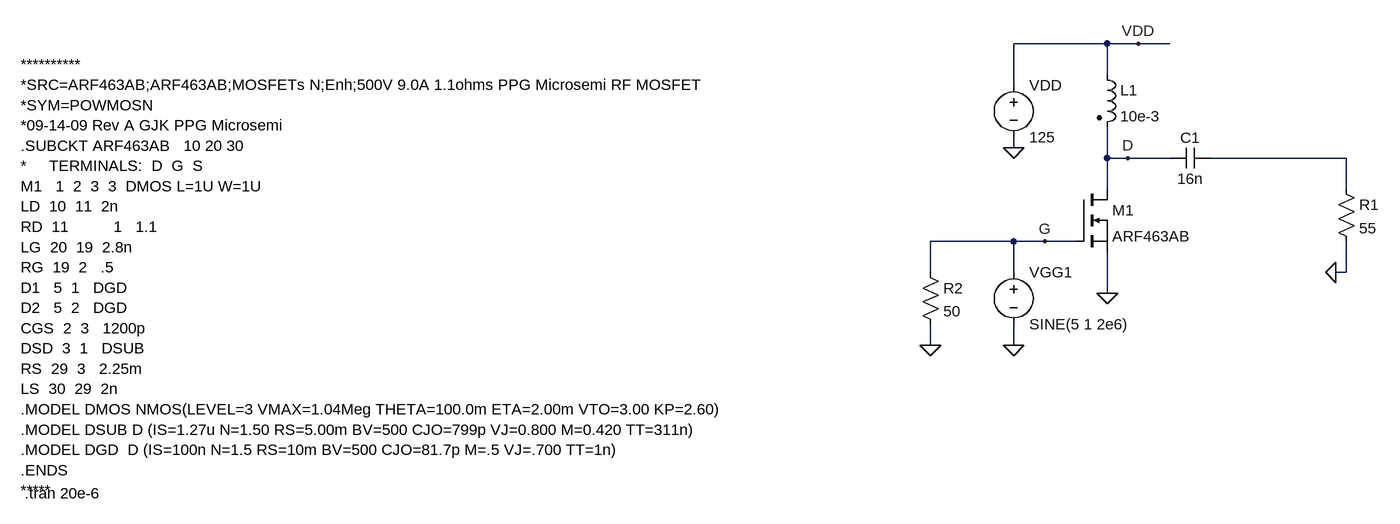
[diagram p0: schematic Clase_A_B.asc]
Clase_A_B.asc, the LTspice schematic file:
Version 4
SHEET 1 880 680
WIRE -480 -784 -624 -784
WIRE -432 -784 -480 -784
WIRE -384 -784 -432 -784
WIRE -480 -736 -480 -784
WIRE -624 -720 -624 -784
WIRE -624 -624 -624 -640
WIRE -480 -608 -480 -656
WIRE -448 -608 -480 -608
WIRE -384 -608 -448 -608
WIRE -112 -608 -320 -608
WIRE -480 -560 -480 -608
WIRE -112 -560 -112 -608
WIRE -624 -480 -752 -480
WIRE -576 -480 -624 -480
WIRE -528 -480 -576 -480
WIRE -752 -432 -752 -480
WIRE -624 -432 -624 -480
WIRE -112 -432 -112 -480
WIRE -112 -432 -128 -432
WIRE -480 -400 -480 -464
WIRE -752 -320 -752 -352
WIRE -624 -320 -624 -352
FLAG -480 -400 0
FLAG -624 -624 0
FLAG -624 -320 0
FLAG -432 -784 VDD
FLAG -448 -608 D
FLAG -576 -480 G
FLAG -128 -432 0
FLAG -752 -320 0
SYMBOL nmos -528 -560 R0
SYMATTR InstName M1
SYMATTR Value ARF463AB
SYMATTR Prefix X
SYMBOL voltage -624 -448 R0
WINDOW 123 0 0 Left 2
WINDOW 39 0 0 Left 2
SYMATTR InstName VGG1
SYMATTR Value SINE(5 1 2e6)
SYMBOL voltage -624 -736 R0
WINDOW 123 0 0 Left 2
WINDOW 39 0 0 Left 2
SYMATTR InstName VDD
SYMATTR Value 125
SYMBOL res -128 -576 R0
SYMATTR InstName R1
SYMATTR Value 55
SYMBOL ind2 -496 -752 R0
SYMATTR InstName L1
SYMATTR Value 10e-3
SYMATTR Type ind
SYMBOL res -768 -448 R0
SYMATTR InstName R2
SYMATTR Value 50
SYMBOL cap -320 -624 R90
WINDOW 0 0 32 VBottom 2
WINDOW 3 32 32 VTop 2
SYMATTR InstName C1
SYMATTR Value 16n
TEXT -2146 -92 Left 2 !.tran 20e-6
TEXT -2152 -752 Left 2 !**********\n*SRC=ARF463AB;ARF463AB;MOSFETs N;Enh;500V 9.0A 1.1ohms PPG Microsemi RF MOSFET\n*SYM=POWMOSN\n*09-14-09 Rev A GJK PPG Microsemi\n.SUBCKT ARF463AB   10 20 30\n*     TERMINALS:  D  G  S\nM1   1  2  3  3  DMOS L=1U W=1U\nLD  10  11  2n\nRD  11          1   1.1\nLG  20  19  2.8n\nRG  19  2   .5\nD1   5  1   DGD\nD2   5  2   DGD\nCGS  2  3   1200p\nDSD  3  1   DSUB\nRS  29  3   2.25m\nLS  30  29  2n\n.MODEL DMOS NMOS(LEVEL=3 VMAX=1.04Meg THETA=100.0m ETA=2.00m VTO=3.00 KP=2.60)\n.MODEL DSUB D (IS=1.27u N=1.50 RS=5.00m BV=500 CJO=799p VJ=0.800 M=0.420 TT=311n)\n.MODEL DGD  D (IS=100n N=1.5 RS=10m BV=500 CJO=81.7p M=.5 VJ=.700 TT=1n)\n.ENDS\n*****

The netlist it stands for:
* Clase_A_B.asc
XM1 D G 0 ARF463AB  ; pins D G S
VGG1 G 0 SINE(5 1 2e6)
VDD VDD 0 125
R1 N001 0 55
L1 VDD D 10e-3
R2 G 0 50
C1 N001 D 16n
.tran 20e-6
**********
*SRC=ARF463AB;ARF463AB;MOSFETs N;Enh;500V 9.0A 1.1ohms PPG Microsemi RF MOSFET
*SYM=POWMOSN
*09-14-09 Rev A GJK PPG Microsemi
.SUBCKT ARF463AB   10 20 30
*     TERMINALS:  D  G  S
M1   1  2  3  3  DMOS L=1U W=1U
LD  10  11  2n
RD  11          1   1.1
LG  20  19  2.8n
RG  19  2   .5
D1   5  1   DGD
D2   5  2   DGD
CGS  2  3   1200p
DSD  3  1   DSUB
RS  29  3   2.25m
LS  30  29  2n
.MODEL DMOS NMOS(LEVEL=3 VMAX=1.04Meg THETA=100.0m ETA=2.00m VTO=3.00 KP=2.60)
.MODEL DSUB D (IS=1.27u N=1.50 RS=5.00m BV=500 CJO=799p VJ=0.800 M=0.420 TT=311n)
.MODEL DGD  D (IS=100n N=1.5 RS=10m BV=500 CJO=81.7p M=.5 VJ=.700 TT=1n)
.ENDS
*****
.backanno
.end